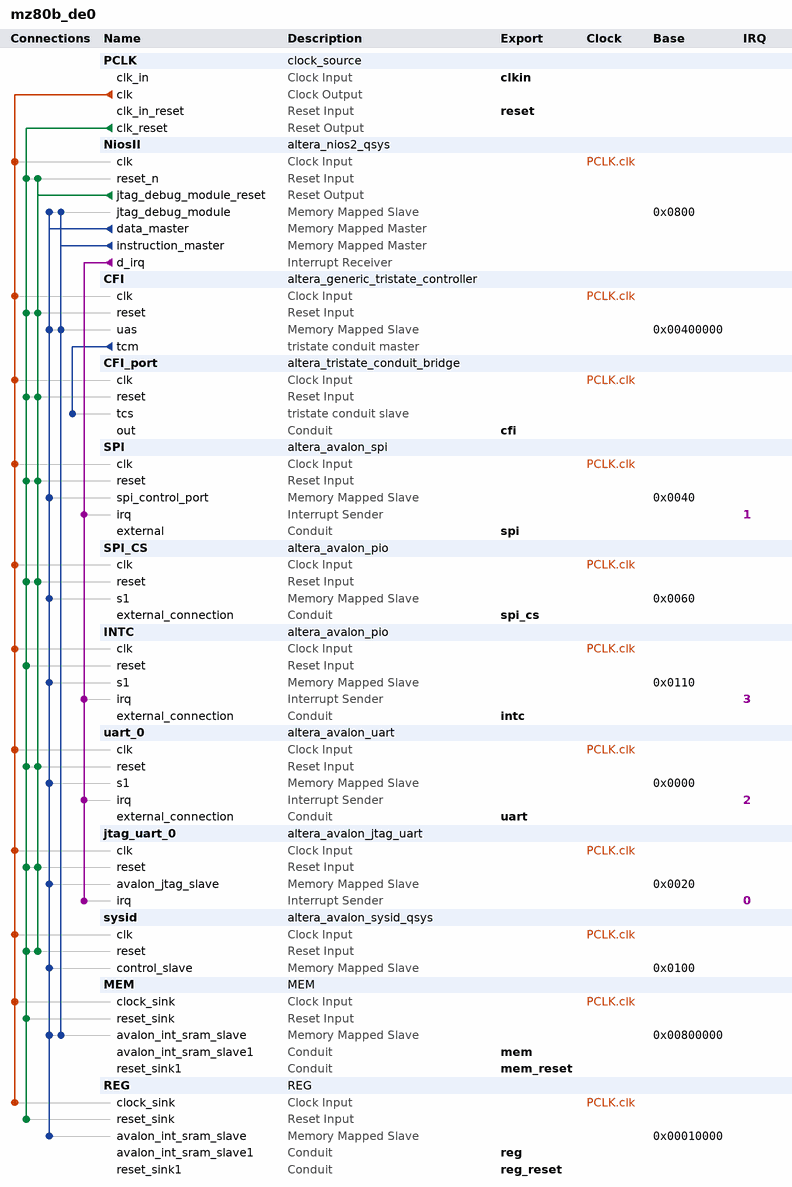
[diagram p0: system contents]
# Platform Designer (Qsys) system mz80b_de0, Cyclone III EP3C16F484C6
# Parameters at their usual value, and those the tool derives, are not listed.
package require -exact qsys 13.1
create_system mz80b_de0
set_project_property DEVICE_FAMILY {Cyclone III}
set_project_property DEVICE EP3C16F484C6

add_instance PCLK clock_source 13.1
set_instance_parameter_value PCLK clockFrequency 20000001

add_instance NiosII altera_nios2_qsys 13.1
set_instance_parameter_value NiosII manuallyAssignCpuID false
set_instance_parameter_value NiosII resetSlave CFI.uas
set_instance_parameter_value NiosII exceptionSlave MEM.avalon_int_sram_slave
set_instance_parameter_value NiosII breakSlave NiosII.jtag_debug_module
set_instance_parameter_value NiosII impl Tiny
set_instance_parameter_value NiosII icache_size 4096

add_instance CFI altera_generic_tristate_controller 13.1
set_instance_parameter_value CFI TCM_ADDRESS_W 22
set_instance_parameter_value CFI TCM_DATA_W 16
set_instance_parameter_value CFI TCM_BYTEENABLE_W 2
set_instance_parameter_value CFI TCM_READ_WAIT 100
set_instance_parameter_value CFI TCM_WRITE_WAIT 100
set_instance_parameter_value CFI TCM_SETUP_WAIT 50
set_instance_parameter_value CFI TCM_DATA_HOLD 50
set_instance_parameter_value CFI TCM_MAX_PENDING_READ_TRANSACTIONS 3
set_instance_parameter_value CFI TCM_TURNAROUND_TIME 2
set_instance_parameter_value CFI TCM_TIMING_UNITS 0
set_instance_parameter_value CFI TCM_READLATENCY 2
set_instance_parameter_value CFI TCM_SYMBOLS_PER_WORD 2
set_instance_parameter_value CFI USE_READ 1
set_instance_parameter_value CFI USE_BEGINTRANSFER 0
set_instance_parameter_value CFI USE_BYTEENABLE 0
set_instance_parameter_value CFI USE_OUTPUTENABLE 0
set_instance_parameter_value CFI ACTIVE_LOW_READ 1
set_instance_parameter_value CFI ACTIVE_LOW_BYTEENABLE 0
set_instance_parameter_value CFI ACTIVE_LOW_OUTPUTENABLE 0
set_instance_parameter_value CFI ACTIVE_LOW_BEGINTRANSFER 0
set_instance_parameter_value CFI CHIPSELECT_THROUGH_READLATENCY 0
set_instance_parameter_value CFI MODULE_ASSIGNMENT_KEYS embeddedsw.configuration.hwClassnameDriverSupportList,embeddedsw.configuration.hwClassnameDriverSupportDefault,embeddedsw.CMacro.SETUP_VALUE,embeddedsw.CMacro.WAIT_VALUE,embeddedsw.CMacro.HOLD_VALUE,embeddedsw.CMacro.TIMING_UNITS,embeddedsw.CMacro.SIZE,embeddedsw.memoryInfo.MEM_INIT_DATA_WIDTH,embeddedsw.memoryInfo.HAS_BYTE_LANE,embeddedsw.memoryInfo.IS_FLASH,embeddedsw.memoryInfo.GENERATE_DAT_SYM,embeddedsw.memoryInfo.GENERATE_FLASH,embeddedsw.memoryInfo.DAT_SYM_INSTALL_DIR,embeddedsw.memoryInfo.FLASH_INSTALL_DIR
set_instance_parameter_value CFI MODULE_ASSIGNMENT_VALUES {altera_avalon_lan91c111:altera_avalon_cfi_flash,altera_avalon_cfi_flash,50,100,50,"ns",4194304u,16,1,1,1,1,SIM_DIR,APP_DIR}
set_instance_parameter_value CFI INTERFACE_ASSIGNMENT_KEYS embeddedsw.configuration.isFlash,embeddedsw.configuration.isMemoryDevice,embeddedsw.configuration.isNonVolatileStorage
set_instance_parameter_value CFI INTERFACE_ASSIGNMENT_VALUES 1,1,1

add_instance CFI_port altera_tristate_conduit_bridge 13.1

add_instance SPI altera_avalon_spi 13.1
set_instance_parameter_value SPI clockPolarity 0
set_instance_parameter_value SPI dataWidth 8
set_instance_parameter_value SPI masterSPI true
set_instance_parameter_value SPI numberOfSlaves 2
set_instance_parameter_value SPI targetClockRate 10000000

add_instance SPI_CS altera_avalon_pio 13.1
set_instance_parameter_value SPI_CS direction Output
set_instance_parameter_value SPI_CS resetValue 1
set_instance_parameter_value SPI_CS width 1

add_instance INTC altera_avalon_pio 13.1
set_instance_parameter_value INTC bitClearingEdgeCapReg true
set_instance_parameter_value INTC direction Input
set_instance_parameter_value INTC generateIRQ true
set_instance_parameter_value INTC width 1

add_instance uart_0 altera_avalon_uart 13.1
set_instance_parameter_value uart_0 baud 115200
set_instance_parameter_value uart_0 dataBits 8
set_instance_parameter_value uart_0 fixedBaud false
set_instance_parameter_value uart_0 parity NONE
set_instance_parameter_value uart_0 stopBits 1
set_instance_parameter_value uart_0 useCtsRts true

add_instance jtag_uart_0 altera_avalon_jtag_uart 13.1
set_instance_parameter_value jtag_uart_0 simInteractiveOptions INTERACTIVE_ASCII_OUTPUT

add_instance sysid altera_avalon_sysid_qsys 13.1
set_instance_parameter_value sysid id 0

add_instance MEM MEM 1.0

add_instance REG REG 1.0

# connections
add_connection PCLK.clk CFI.clk clock
add_connection PCLK.clk CFI_port.clk clock
add_connection PCLK.clk INTC.clk clock
add_connection PCLK.clk jtag_uart_0.clk clock
add_connection PCLK.clk MEM.clock_sink clock
add_connection PCLK.clk NiosII.clk clock
add_connection PCLK.clk REG.clock_sink clock
add_connection PCLK.clk SPI.clk clock
add_connection PCLK.clk SPI_CS.clk clock
add_connection PCLK.clk sysid.clk clock
add_connection PCLK.clk uart_0.clk clock
add_connection NiosII.jtag_debug_module_reset CFI.reset reset
add_connection NiosII.jtag_debug_module_reset CFI_port.reset reset
add_connection NiosII.jtag_debug_module_reset jtag_uart_0.reset reset
add_connection NiosII.jtag_debug_module_reset NiosII.reset_n reset
add_connection NiosII.jtag_debug_module_reset SPI.reset reset
add_connection NiosII.jtag_debug_module_reset SPI_CS.reset reset
add_connection NiosII.jtag_debug_module_reset sysid.reset reset
add_connection NiosII.jtag_debug_module_reset uart_0.reset reset
add_connection PCLK.clk_reset CFI.reset reset
add_connection PCLK.clk_reset CFI_port.reset reset
add_connection PCLK.clk_reset INTC.reset reset
add_connection PCLK.clk_reset jtag_uart_0.reset reset
add_connection PCLK.clk_reset MEM.reset_sink reset
add_connection PCLK.clk_reset NiosII.reset_n reset
add_connection PCLK.clk_reset REG.reset_sink reset
add_connection PCLK.clk_reset SPI.reset reset
add_connection PCLK.clk_reset SPI_CS.reset reset
add_connection PCLK.clk_reset sysid.reset reset
add_connection PCLK.clk_reset uart_0.reset reset
add_connection NiosII.data_master CFI.uas avalon
set_connection_parameter_value NiosII.data_master/CFI.uas baseAddress 0x00400000
add_connection NiosII.data_master INTC.s1 avalon
set_connection_parameter_value NiosII.data_master/INTC.s1 baseAddress 0x0110
add_connection NiosII.data_master jtag_uart_0.avalon_jtag_slave avalon
set_connection_parameter_value NiosII.data_master/jtag_uart_0.avalon_jtag_slave baseAddress 0x0020
add_connection NiosII.data_master MEM.avalon_int_sram_slave avalon
set_connection_parameter_value NiosII.data_master/MEM.avalon_int_sram_slave baseAddress 0x00800000
add_connection NiosII.data_master NiosII.jtag_debug_module avalon
set_connection_parameter_value NiosII.data_master/NiosII.jtag_debug_module baseAddress 0x0800
add_connection NiosII.data_master REG.avalon_int_sram_slave avalon
set_connection_parameter_value NiosII.data_master/REG.avalon_int_sram_slave baseAddress 0x00010000
add_connection NiosII.data_master SPI.spi_control_port avalon
set_connection_parameter_value NiosII.data_master/SPI.spi_control_port baseAddress 0x0040
add_connection NiosII.data_master SPI_CS.s1 avalon
set_connection_parameter_value NiosII.data_master/SPI_CS.s1 baseAddress 0x0060
add_connection NiosII.data_master sysid.control_slave avalon
set_connection_parameter_value NiosII.data_master/sysid.control_slave baseAddress 0x0100
add_connection NiosII.data_master uart_0.s1 avalon
set_connection_parameter_value NiosII.data_master/uart_0.s1 baseAddress 0x0000
add_connection NiosII.instruction_master CFI.uas avalon
set_connection_parameter_value NiosII.instruction_master/CFI.uas baseAddress 0x00400000
add_connection NiosII.instruction_master MEM.avalon_int_sram_slave avalon
set_connection_parameter_value NiosII.instruction_master/MEM.avalon_int_sram_slave baseAddress 0x00800000
add_connection NiosII.instruction_master NiosII.jtag_debug_module avalon
set_connection_parameter_value NiosII.instruction_master/NiosII.jtag_debug_module baseAddress 0x0800
add_connection NiosII.d_irq INTC.irq interrupt
set_connection_parameter_value NiosII.d_irq/INTC.irq irqNumber 3
add_connection NiosII.d_irq jtag_uart_0.irq interrupt
set_connection_parameter_value NiosII.d_irq/jtag_uart_0.irq irqNumber 0
add_connection NiosII.d_irq SPI.irq interrupt
set_connection_parameter_value NiosII.d_irq/SPI.irq irqNumber 1
add_connection NiosII.d_irq uart_0.irq interrupt
set_connection_parameter_value NiosII.d_irq/uart_0.irq irqNumber 2
add_connection CFI.tcm CFI_port.tcs tristate_conduit

# exported interfaces
add_interface spi_cs conduit end
set_interface_property spi_cs EXPORT_OF SPI_CS.external_connection
add_interface cfi conduit end
set_interface_property cfi EXPORT_OF CFI_port.out
add_interface spi conduit end
set_interface_property spi EXPORT_OF SPI.external
add_interface uart conduit end
set_interface_property uart EXPORT_OF uart_0.external_connection
add_interface clkin clock sink
set_interface_property clkin EXPORT_OF PCLK.clk_in
add_interface mem conduit end
set_interface_property mem EXPORT_OF MEM.avalon_int_sram_slave1
add_interface mem_reset conduit end
set_interface_property mem_reset EXPORT_OF MEM.reset_sink1
add_interface reset reset sink
set_interface_property reset EXPORT_OF PCLK.clk_in_reset
add_interface reg conduit end
set_interface_property reg EXPORT_OF REG.avalon_int_sram_slave1
add_interface reg_reset conduit end
set_interface_property reg_reset EXPORT_OF REG.reset_sink1
add_interface intc conduit end
set_interface_property intc EXPORT_OF INTC.external_connection

set_interconnect_requirement {$system} qsys_mm.clockCrossingAdapter HANDSHAKE
set_interconnect_requirement {$system} qsys_mm.maxAdditionalLatency 0

save_system mz80b_de0.qsys
